# Altium schematic sheet CAN.SchDoc
size A; SheetNumber: 2; SheetTotal: 4
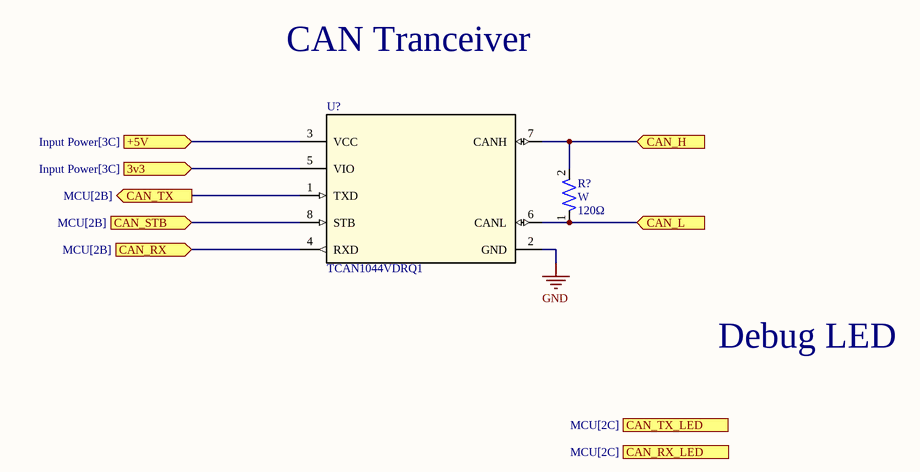
[diagram p0: CAN.SchDoc]

## Parts
R?  Wattage: W  Resistance: 120Ω  [RES-0603]  (hidden comment: RES 0603)
U?  TCAN1044VDRQ1  [IC-8SOIC]

## Ports
3v3 (in, see Input Power[3C]), +5V (in, see Input Power[3C]), CAN_H (in), CAN_L (in), CAN_RX (in, see MCU[2B]), CAN_RX_LED (see MCU[2C]), CAN_STB (in, see MCU[2B]), CAN_TX (out, see MCU[2B]), CAN_TX_LED (see MCU[2C])

## Nets
GND: U?.2(GND)
3v3: U?.5(VIO) ; port 3v3
+5V: U?.3(VCC) ; port +5V
CAN_H: R?.2 U?.7(CANH) ; port CAN_H
CAN_L: R?.1 U?.6(CANL) ; port CAN_L
CAN_RX: U?.4(RXD) ; port CAN_RX
CAN_STB: U?.8(STB) ; port CAN_STB
CAN_TX: U?.1(TXD) ; port CAN_TX

## Notes on the sheet
- CAN Tranceiver
- Debug LED

## Library data of the parts
U? = IC-CAN-0001: IC TRANSCEIVER 1/1 8SOIC; ComponentLink1Description: Datasheet; ComponentLink1URL: https://www.ti.com/lit/ds/symlink/tcan1044-q1.pdf?HQS=dis-dk-null-digikeymode-dsf-pf-null-wwe&ts=1728758303289&ref_url=https%253A%252F%252Fwww.ti.com%252Fgeneral%252Fdocs%252Fsuppproductinfo.tsp%253FdistId%253D10%2526gotoUrl%253Dhttps%253A%252F%252Fwww.ti.com%252Flit%252Fgpn%252Ftcan1044-q1